# EAGLE design Pcbdesign_power_module (EAGLE 8.0.1)
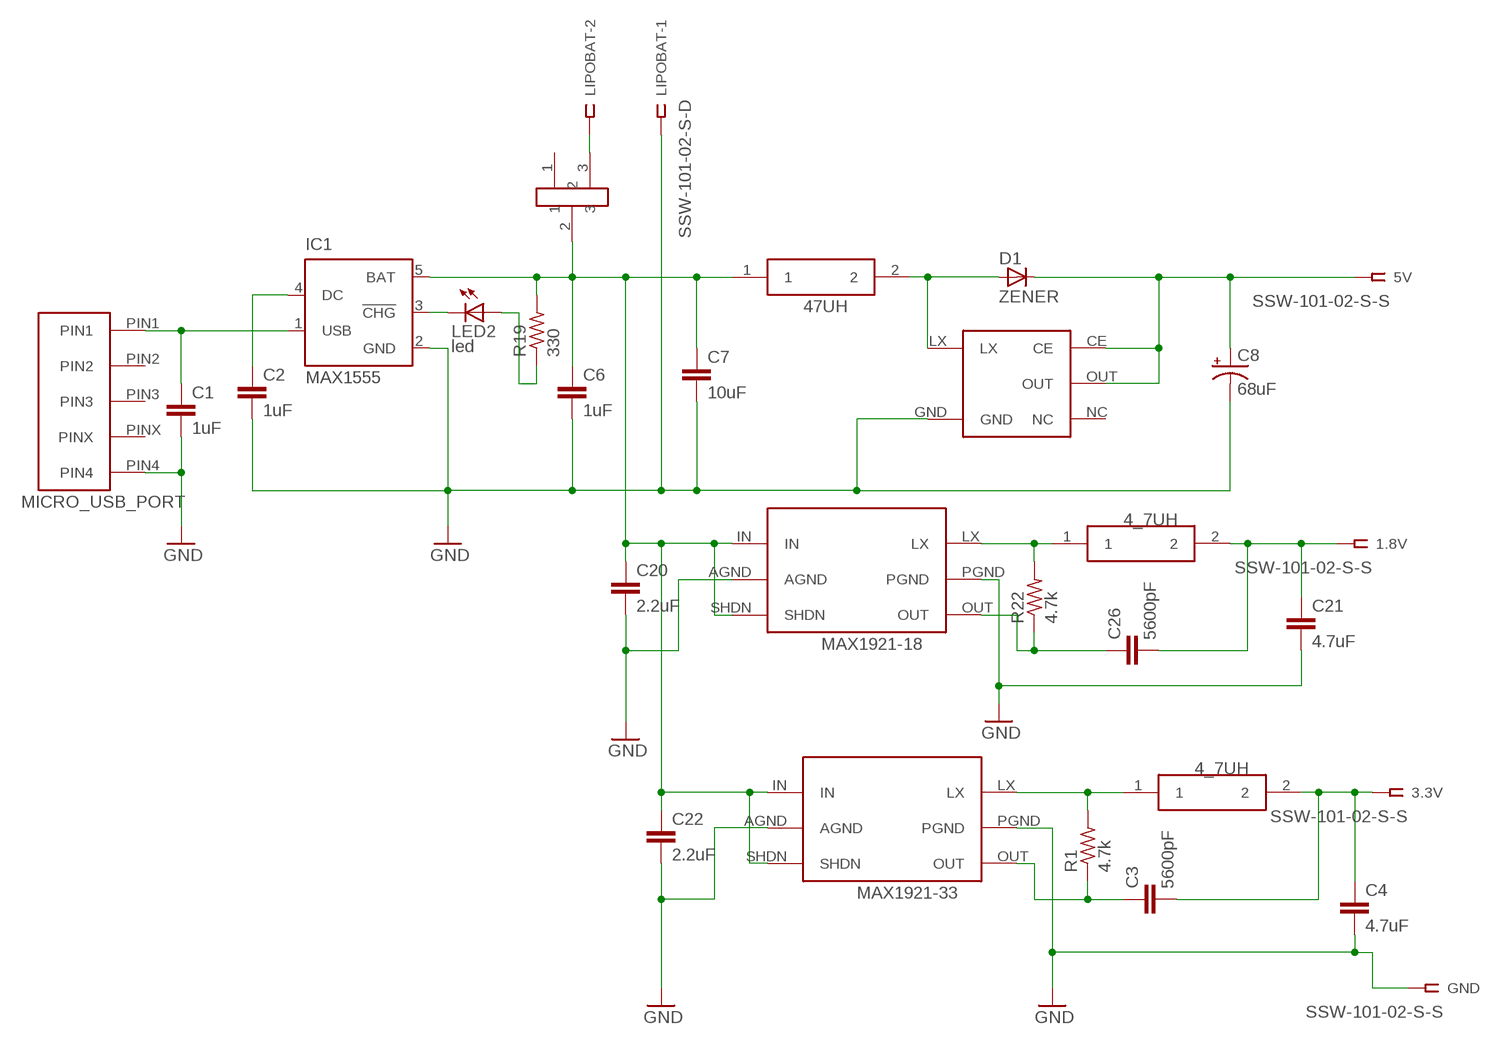
[diagram p0: schematic, sheet 1]

## Parts
1.8V  SSW-101-02-S-S  [SSW-101-02-S-S]
3.3V  SSW-101-02-S-S  [SSW-101-02-S-S]
5V  SSW-101-02-S-S  [SSW-101-02-S-S]
10UH  SUMIDA_10U  [SUMIDA_10U]
C1  1uF  C-EUC0805K  [C0805K]
C2  1uF  C-EUC0805K  [C0805K]
C3  5600pF  C-EUC0805K  [C0805K]
C4  4.7uF  C-EUC0805K  [C0805K]
C6  1uF  C-EUC0805K  [C0805K]
C7  10uF  C-EUC0805K  [C0805K]
C8  68uF  CPOL-USC/6032-28R  [C/6032-28R]
C20  2.2uF  C-EUC0805K  [C0805K]
C21  4.7uF  C-EUC0805K  [C0805K]
C22  2.2uF  C-EUC0805K  [C0805K]
C26  5600pF  C-EUC0805K  [C0805K]
D1  ZENER  D-SOD123  [SOD123]
GND  SSW-101-02-S-S  [SSW-101-02-S-S]
IC1  MAX1555  [SOT23-5L]
LED2  led  LEDCHIPLED_0603  [CHIPLED_0603]
LIPOBAT  SSW-101-02-S-D  [SSW-101-02-S-D]
MAX1920  MAX1921  [MAX1921]
MAX1921-18  MAX1921  [MAX1921]
MICRO_USB  10118192  [10118192]
R1  4.7k  R-US_R0805  [R0805]
R19  330  R-US_R0805  [R0805]
R22  4.7k  R-US_R0805  [R0805]
U$1  SUMIDA_4.7U  [SUMIDA_4.7U]
U$2  SUMIDA_4.7U  [SUMIDA_4.7U]
U$3  NPC1402  [NPC1402]
U$4  SWITCH111  [SWITCH111]

## Nets
GND: C1.2 C2.2 C4.2 C6.2 C7.2 C8.- C20.2 C21.2 C22.2 GND.1 IC1.2(GND) LIPOBAT.1 MAX1920.AGND MAX1920.PGND MAX1921-18.AGND MAX1921-18.PGND MICRO_USB.PIN4 U$3.GND
N$1: C1.1 IC1.1(USB) MICRO_USB.PIN1
N$2: 5V.1 C8.+ D1.1(C) U$3.CE U$3.OUT
N$3: IC1.3(!CHG) LED2.C
N$4: LED2.A R19.1
N$5: MAX1920.LX R1.2 U$2.1
N$7: LIPOBAT.2 U$4.3
N$9: 1.8V.1 C21.1 C26.2 U$1.2
N$10: MAX1921-18.LX R22.2 U$1.1
N$11: C26.1 MAX1921-18.OUT R22.1
N$12: 3.3V.1 C3.2 C4.1 U$2.2
N$13: C3.1 MAX1920.OUT R1.1
N$14: 10UH.2 D1.2(A) U$3.LX
N$15: C2.1 IC1.4(DC)
N$16: 10UH.1 C6.1 C7.1 C20.1 C22.1 IC1.5(BAT) MAX1920.IN MAX1920.SHDN MAX1921-18.IN MAX1921-18.SHDN R19.2 U$4.2
Unconnected: MICRO_USB.PIN2 MICRO_USB.PIN3 MICRO_USB.PINX U$3.NC U$4.1

## Library data of the parts
1.8V 3.3V 5V GND = con-samtec:SSW-101-02-S-S: THROUGH-HOLE .025" SQ POST SOCKET Source: Samtec SSW.pdf; MPN: SSW-101-02-S-S; OC_FARNELL: unknown; OC_NEWARK: 11P9336
10UH = SUMIDA_10U:SUMIDA_10U
C1-C4 C6 C7 C20-C22 C26 = resistor:C-EU: CAPACITOR, European symbol
C8 = rcl:CPOL-US: POLARIZED CAPACITOR, American symbol
D1 = semicon-smd-ipc:D-: DIODE unfilled
IC1 = maxim:MAX1555: Dual-Input USB/AC Adapter 1-Cell Li+ Battery Chargers Source: http://www.maxim-ic.com .. MAX1551-MAX1555.pdf; MF: MAXIM; MPN: MAX1555EZK+T; OC_FARNELL: 1628222; OC_NEWARK: 59J2761
LED2 = led:LED: LED OSRAM: - CHIPLED LG R971, LG N971, LY N971, LG Q971, LY Q971, LO R971, LY R971 LH N974, LH R974 LS Q976, LO Q976, LY Q976 LO Q996 - Hyper CHIPLED LW Q18S LB Q993, LB Q99A, LB R99A - SideLED LS A670, LO A670, LY A670, LG A670, LP A670 LB A673, LV A673, LT A673, LW A673 LH A674 LY A675 LS A676, LA A676, LO A676, LY A676, LW A676 LS A679, LY A679, LG A679 - Hyper Micro SIDELED® LS Y876, LA Y876, LO Y876, LY Y876 LT Y87S - SmartLED LW L88C, LW L88S LB L89C, LB L89S, LG L890 LS L89K, LO L89K, LY L89K LS L896, LA L896, LO L896, LY L896 - TOPLED LS T670, LO T670, LY T670, LG T670, LP T670 LSG T670, LSP T670, LSY T670, LOP T670, LYG T670 LG T671, LOG T671, LSG T671 LB T673, LV T673, LT T673, LW T673 LH T674 LS T676, LA T676, LO T676, LY T676, LB T676, LH T676, LSB T676, LW T676 LB T67C, LV T67C, LT T67C, LS T67K, LO T67K, LY T67K, LW E67C LS E67B, LA E67B, LO E67B, LY E67B, LB E67C, LV E67C, LT E67C LW T67C LS T679, LY T679, LG T679 LS T770, LO T770, LY T770, LG T770, LP T770 LB T773, LV T773, LT T773, LW T773 LH T774 LS E675, LA E675, LY E675, LS T675 LS T776, LA T776, LO T776, LY T776, LB T776 LHGB T686 LT T68C, LB T68C - Hyper Mini TOPLED® LB M676 - Mini TOPLED Santana® LG M470 LS M47K, LO M47K, LY M47K Source: http://www.osram.convergy.de LUXEON: - LUMILED® LXK2-PW12-R00, LXK2-PW12-S00, LXK2-PW14-U00, LXK2-PW14-V00 LXK2-PM12-R00, LXK2-PM12-S00, LXK2-PM14-U00 LXK2-PE12-Q00, LXK2-PE12-R00, LXK2-PE12-S00, LXK2-PE14-T00, LXK2-PE14-U00 LXK2-PB12-K00, LXK2-PB12-L00, LXK2-PB12-M00, LXK2-PB14-N00, LXK2-PB14-P00, LXK2-PB14-Q00 LXK2-PR12-L00, LXK2-PR12-M00, LXK2-PR14-Q00, LXK2-PR14-R00 LXK2-PD12-Q00, LXK2-PD12-R00, LXK2-PD12-S00 LXK2-PH12-R00, LXK2-PH12-S00 LXK2-PL12-P00, LXK2-PL12-Q00, LXK2-PL12-R00 Source: www.luxeon.com KINGBRIGHT: KA-3528ASYC Source: www.kingbright.com
LIPOBAT = con-samtec:SSW-101-02-S-D: THROUGH-HOLE .025" SQ POST SOCKET Source: Samtec SSW.pdf; MPN: SSW-101-02-S-D; OC_FARNELL: unknown; OC_NEWARK: 82P1456
MAX1920 MAX1921-18 = max1920_max1921:MAX1921
MICRO_USB = 10118192:10118192
R1 R19 R22 = resistor:R-US_: RESISTOR, American symbol
U$1 U$2 = SUMIDA_4.7U:SUMIDA_4.7U
U$3 = NCP1402:NPC1402
U$4 = switch111:SWITCH111

## Board
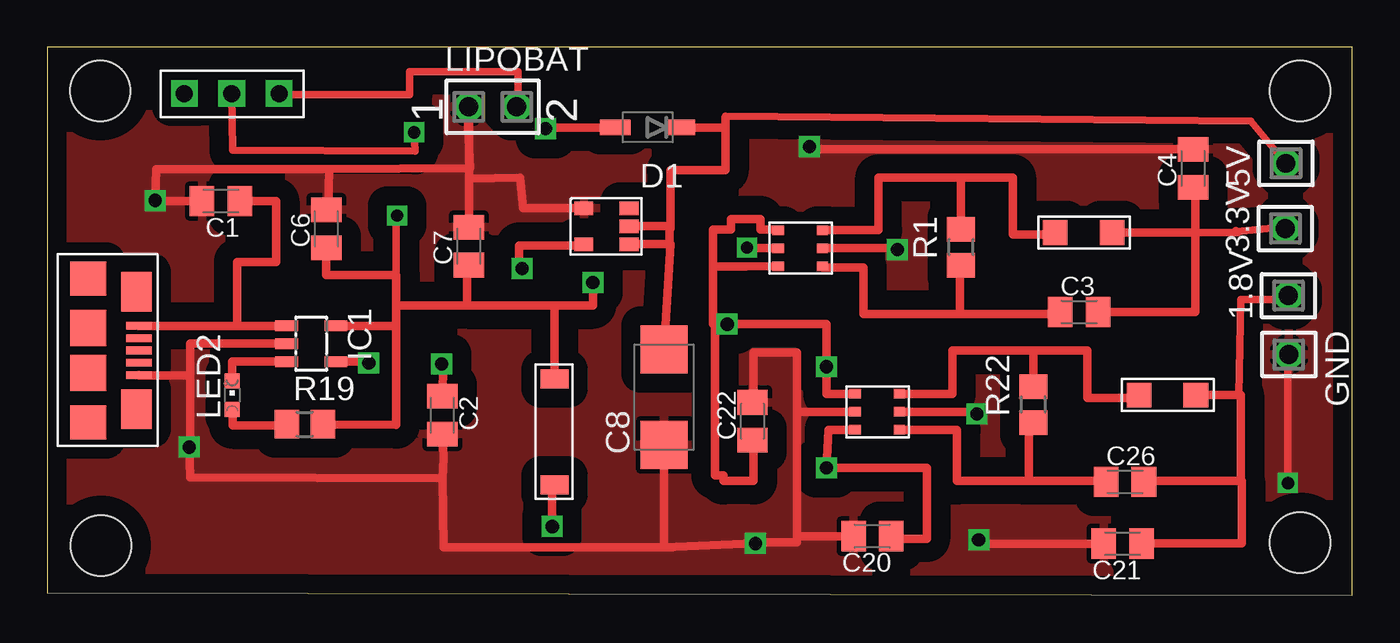
[diagram p1: board, top side]
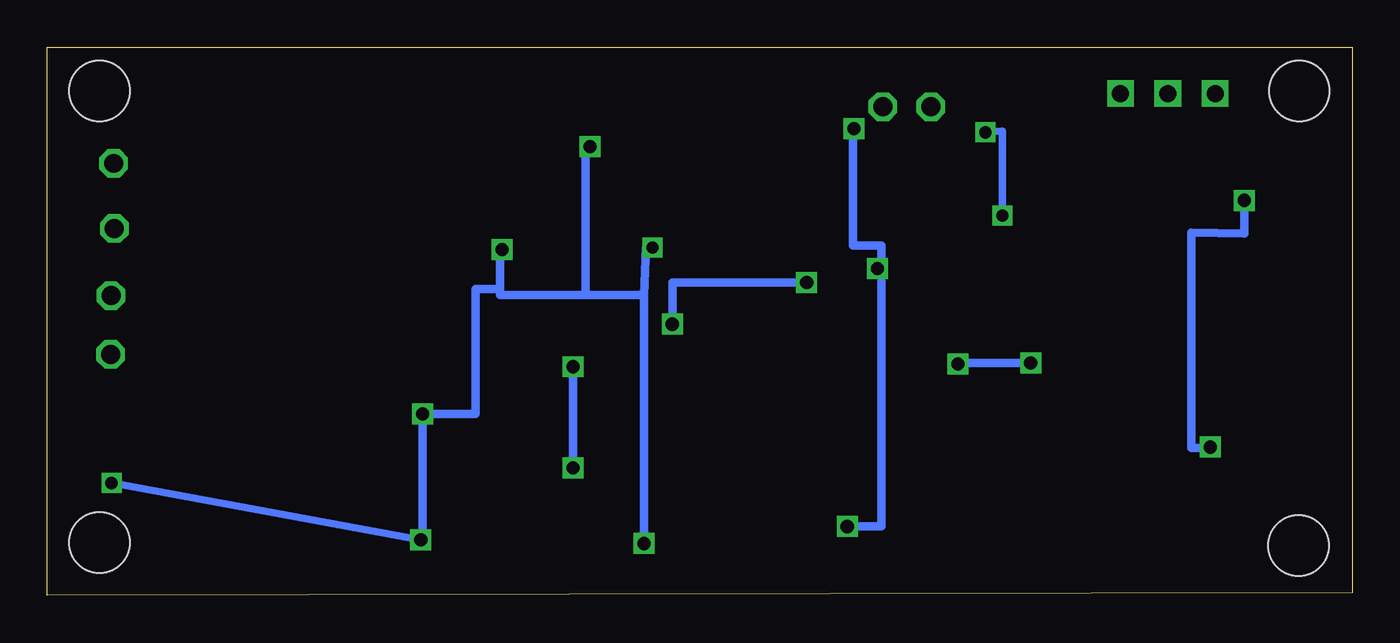
[diagram p2: board, bottom side, seen from below]

Size 69 x 29 mm. Coordinates in mm from the lower left corner, seen from the top.
Outline: 0,0.15 69,0 69,29 0,29 0,0.15
Copper layers (1*16): Top 0.035mm / dielectric 1.5mm / Bottom 0.035mm
Design rules "default": minimum track width 10mil, minimum drill 24mil, track to track 8mil, track to pad 8mil, pad to pad 8mil, via to via 8mil, smd to smd 8mil, copper to edge 40mil, drill to drill 8mil, minimum pad ring 10mil, minimum via ring 8mil, stop-mask expansion 4mil, vias tented up to drill 0mil, thermal gap 10mil
Holes 3.2 mm at 2.8,26.7 66.25,26.7 2.85,2.65 66.25,2.8

### Footprints (pad centres in the part's own frame; a part is rotated, then mirrored left to right if it is on the bottom)
SSW-101-02-S-S = drill 1 pad 1.5 octagon: 1 0,0
SUMIDA_10U = smd 1 x 1.5: 1 0,0; 2 5.6,0
C0805K = smd 1.3 x 1.6: 1 -1,0; 2 1,0
C/6032-28R = smd 2.55 x 2.5: + 2.525,0; - -2.525,0
SOD123 = smd 1.6 x 0.8: 1 -1.7,0; 2 1.7,0
SOT23-5L = smd 0.55 x 1.2: 1 -0.95,-1.3; 2 0,-1.3; 3 0.95,-1.3; 4 0.95,1.3; 5 -0.95,1.3
CHIPLED_0603 = smd 0.8 x 0.8: A 0,-0.75; C 0,0.75
SSW-101-02-S-D = drill 1 pad 1.5 octagon: 1 0,-1.27; 2 0,1.27
MAX1921 = smd 0.6 x 0.5: AGND 0,0.95; IN 0,1.9; LX 2.35,1.9; OUT 2.35,0; PGND 2.35,0.95; SHDN 0,0
10118192 = smd 2.1 x 1.6: P$1 0.7,2.55; P$2 6.9,2.55 | smd 1.9 x 1.9: P$3 2.6,0; P$4 5,0 | smd 1.8 x 1.9: P$5 0,0; P$6 7.6,0 | smd 0.4 x 1.35: PIN1 2.5,2.68; PIN2 3.15,2.68; PIN3 3.8,2.68; PIN4 5.1,2.68; PINX 4.45,2.68
R0805 = smd 1.3 x 1.5: 1 -0.95,0; 2 0.95,0
SUMIDA_4.7U = smd 1.3 x 1.3: 1 0,0; 2 3,0
NPC1402 = smd 0.7 x 1: CE 1.9,2.4; GND 0,0; LX 1.9,0; NC 0,2.4; OUT 0.95,2.4
SWITCH111 = drill 0.9 square: 1 -2.5,0; 2 0,0; 3 2.5,0

### Placement (x,y rotation side)
1.8V  65.63,15.86 0 top
3.3V  65.46,19.41 0 top
5V  65.49,22.86 0 top
10UH  26.82,11.46 270 top
C1  9.18,20.86 180 top
C2  20.89,9.54 270 top
C3  54.56,14.99 0 top
C4  60.59,22.6 90 top
C6  14.76,19.4 90 top
C7  22.29,18.48 90 top
C8  32.61,10.49 90 top
C20  43.63,3.14 180 top
C21  56.86,2.74 180 top
C22  37.29,9.21 90 top
C26  56.98,6.01 0 top
D1  31.74,24.76 180 top
GND  65.65,12.75 180 top
IC1  13.96,13.32 270 top
LED2  9.78,10.59 0 top
LIPOBAT  23.55,25.85 270 top
MAX1920  38.64,17.42 0 top
MAX1921-18  42.71,8.77 0 top
MICRO_USB  2.16,16.76 270 top
R1  48.31,18.42 90 top
R19  13.62,9.06 0 top
R22  52.14,10.1 90 top
U$1  57.73,10.6 0 top
U$2  53.3,19.2 0 top
U$3  28.37,20.48 270 top
U$4  9.75,26.55 0 top

### Tracks (layer width: path | path; a pad name or v marks a point on that pad's centre or on a via)
GND  (via drill 0.65, 0.7)
  Top 0.406: GND.1 65.6,12.75 v65.6,5.95
  Top 0.45: IC1.2 7.55,13.32 7.55,11.65 | 7.55,11.65 MICRO_USB.PIN4 | C1.2 5.7,20.86 v5.7,20.9 5.75,22.55 14.9,22.55 | 7.55,11.65 7.55,7.85 v7.5,7.85 7.55,6.25 20.9,6.2 | C2.2 20.95,7.29 20.9,6.2 | C6.2 14.85,20.4 14.9,22.55 | 14.9,22.55 22.35,22.6 22.25,24.7 LIPOBAT.1 22.29,24.7 22.29,22.05 | 22.29,22.05 C7.2 | U$3.GND 25.15,20.48 25,22.1 22.29,22.05 | C8.- 32.6,7.92 32.6,2.55 | 32.6,2.55 20.95,2.55 20.9,6.2 | MAX1920.AGND 37,18.37 v37,18.4 | 32.6,2.55 v37.45,2.75 37.35,2.8 39.65,2.8 39.65,3.14 | 32.6,2.55 33.05,2.55 | MAX1920.PGND 44.95,18.37 v44.95,18.3 | C4.2 40.3,23.6 v40.3,23.75 | 39.65,9.72 MAX1921-18.AGND | 39.65,3.14 39.65,9.72 | C22.2 37.35,10.21 37.35,12.85 39.65,12.85 39.65,9.72 | C20.2 39.65,3.14 | MAX1921-18.PGND 49.15,9.72 v49.15,9.6 | C21.2 49.25,2.74 v49.25,2.95
  Bottom 0.406: v49.25,2.95 v65.6,5.95
  Bottom 0.45: v5.7,20.9 5.7,19.15 8.5,19.2 8.5,7.8 7.55,7.8 v7.5,7.85 | v37,18.4 37.35,18.4 37.45,15.9 | 37.45,15.9 v37.45,2.75 | v44.95,18.3 45.05,18.3 45.05,16.2 | 40.55,15.9 45.05,15.9 45.05,16.2 | 40.55,15.9 37.45,15.9 | v40.3,23.75 40.55,23.75 40.55,15.9 | 45.05,16.2 46.35,16.2 46.35,9.6 v49.15,9.6 49.15,2.95 v49.25,2.95
  pour Top (isolate 1.016): 0.5,0.65 68.5,0.65 68.5,0.95 68.45,0.95 68.45,28.7 0.4,28.7 0.4,0.6
N$1
  Top 0.45: 10.05,14.26 MICRO_USB.PIN1 | 10.05,14.26 IC1.1 | C1.1 12.1,20.86 12.1,17.65 10.05,17.65 10.05,14.26
N$2
  Top 0.406: 5V.1 63.65,25.1 35.85,25.35 35.85,24.45
  Top 0.45: 32.95,19.53 U$3.OUT | 32.95,19.53 32.95,19.4 32.9,19.4 32.9,18.6 | 32.9,18.6 30.77,18.6 U$3.CE | 35.85,24.76 D1.1 | 32.95,19.53 32.95,22.5 35.85,22.5 35.85,24.45 35.85,24.76 | 32.9,18.6 32.96,18.6 C8.+ | 35.85,25.31 35.85,24.76
N$3
  Top 0.45: IC1.3 9.78,12.37 LED2.C
N$4
  Top 0.45: LED2.A 9.8,9.54 9.8,9 12.47,9 R19.1
N$5
  Top 0.45: MAX1920.LX 43.95,19.32 43.95,22.1 48.31,22.1 | 48.31,22.1 R1.2 | 48.31,22.1 51.05,22.1 51.05,19.1 53.3,19.1 U$2.1
N$7
  Top 0.406: LIPOBAT.2 24.9,25.85 24.9,27.7 19.15,27.7 19.15,26.5 12.25,26.5 U$4.3
N$9
  Top 0.406: 63.1,10.6 63,10.6 63.1,15.65 65.68,15.65 1.8V.1
  Top 0.45: U$1.2 63.1,10.6 63.1,6.05 | 63.1,6.05 57.98,6.05 C26.2 | 63.1,6.05 63.15,6.05 63.15,2.75 C21.1
N$10
  Top 0.45: MAX1921-18.LX 47.75,10.67 47.75,10.65 47.85,10.65 47.85,12.95 52.14,12.95 | 52.14,12.95 R22.2 | 52.14,12.95 55,12.95 55,10.45 57.73,10.45 U$1.1
N$11
  Top 0.45: R22.1 51.9,9.15 51.9,6.05 51.65,6.05 | 51.65,6.05 48.1,6.05 48.1,8.75 45.06,8.75 MAX1921-18.OUT | 51.65,6.05 55.98,6.05 C26.1
N$12
  Top 0.406: 60.7,19.2 62.95,19.2 62.9,19.25 | 62.85,19.3 62.9,19.25 | 62.9,19.25 65.06,19.45 3.3V.1
  Top 0.45: U$2.2 60.7,19.2 | C3.2 60.7,15 60.7,19.2 | C4.1 60.7,21.6 60.7,19.2
N$13
  Top 0.45: R1.1 48.25,17.47 48.25,14.9 | 48.25,14.9 43.15,14.9 43.15,17.35 40.99,17.35 MAX1920.OUT | 48.25,14.9 53.56,14.9 C3.1
N$14  (via drill 0.7)
  Top 0.45: 10UH.2 26.7,5.86 v26.7,3.65 | v25.1,17.3 24.95,17.3 24.95,18.5 28.37,18.5 U$3.LX | D1.2 26.35,24.76 v26.35,24.7
  Bottom 0.45: v26.7,3.65 24.9,3.65 24.9,17.3 | 24.9,17.3 v25.1,17.3 | v26.35,24.7 26.4,24.7 26.4,18.5 24.9,18.5 24.9,17.3
N$15  (via drill 0.7)
  Top 0.45: IC1.4 17,12.37 v17,12.3 | v20.85,12.25 20.94,12.25 C2.1
  Bottom 0.45: v17,12.3 20.85,12.3 v20.85,12.25
N$16  (via drill 0.65, 0.7)
  Top 0.406: v19.4,24.5 19.45,23.5 9.8,23.55 U$4.2 | v18.5,20.1 18.45,20.1 18.45,16.95
  Top 0.45: R19.2 18.45,9.01 18.45,14.25 | 18.45,14.25 15.26,14.25 IC1.5 | C6.1 14.75,16.95 18.45,16.95 18.45,15.35 | 18.45,15.35 18.45,14.25 | C7.1 22.2,17.48 22.2,15.35 | 22.2,15.35 18.45,15.35 | 22.2,15.35 26.82,15.35 | 26.82,15.35 10UH.1 | 26.82,15.35 28.85,15.35 v28.85,16.55 | v35.95,14.35 35.2,14.35 35.2,17.4 | 35.2,17.4 36.94,17.4 MAX1920.SHDN | C22.1 37.35,8.21 37.35,6.05 35.75,6.05 35.75,6.35 35.3,6.35 35.3,14.35 v35.95,14.35 | v35.95,14.35 41.2,14.35 v41.2,12.1 41.2,10.65 42.71,10.65 MAX1921-18.IN | MAX1921-18.SHDN 41.3,8.77 v41.2,6.75 46.5,6.75 46.5,3 44.63,3 C20.1 | 35.2,17.4 35.2,19.35 36.15,19.35 36.15,19.9 37.7,19.9 37.7,19.35 38.64,19.35 MAX1920.IN
  Bottom 0.406: v19.4,24.5 18.5,24.55 v18.5,20.1
  Bottom 0.45: v28.85,16.55 35.95,16.55 v35.95,14.35 | 41.2,6.6 v41.2,6.75 v41.2,12.1